# Altium schematic sheet EG8010.SchDoc: =DocumentName
size A4; CompanyName: "AS Manufacturing" LLC; Organization: "AS Manufacturing" LLC; Address1: 5 Sklyarenka St.; Address2: Kyiv 04073; Address3: Ukraine; Address4: https://ajax.systems/en/; SheetNumber: 3; SheetTotal: 10; Template_version: 1.0.1
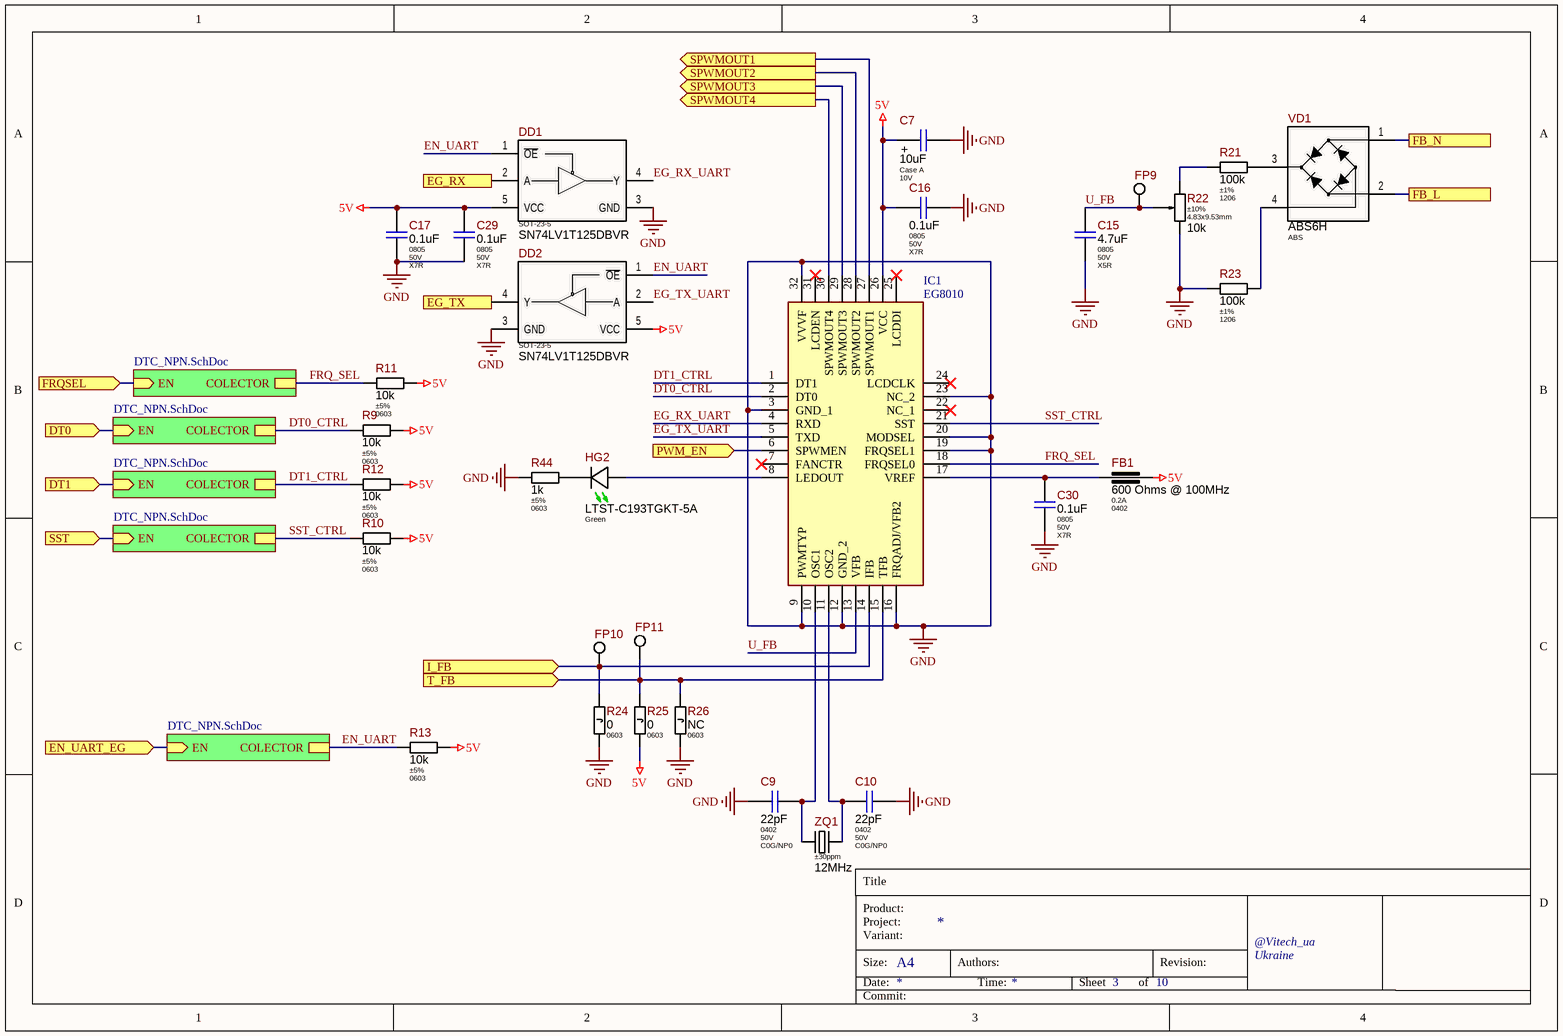
[diagram p0: EG8010.SchDoc]

## Parts
C7  Package: Case A  Voltage: 10V  [C_TANTAL_CASE_A_MED]  (hidden comment: 10uF)
C9  Package: 0402  Voltage: 50V  Dielectric Type: C0G/NP0  [C_CERAMIC_0402_MED]  (hidden comment: 22pF)
C10  Package: 0402  Voltage: 50V  Dielectric Type: C0G/NP0  [C_CERAMIC_0402_MED]  (hidden comment: 22pF)
C15  Package: 0805  Voltage: 50V  Dielectric Type: X5R  [C_CERAMIC_0805_MED]  (hidden comment: 4.7uF)
C16  Package: 0805  Voltage: 50V  Dielectric Type: X7R  [CAP-0805(2012)X85T10]  (hidden comment: 0.1uF)
C17  Package: 0805  Voltage: 50V  Dielectric Type: X7R  [CAP-0805(2012)X85T10]  (hidden comment: 0.1uF)
C29  Package: 0805  Voltage: 50V  Dielectric Type: X7R  [CAP-0805(2012)X85T10]  (hidden comment: 0.1uF)
C30  Package: 0805  Voltage: 50V  Dielectric Type: X7R  [CAP-0805(2012)X85T10]  (hidden comment: 0.1uF)
DD1  SN74LV1T125DBVR  [SOT-23-5]
DD2  SN74LV1T125DBVR  [SOT-23-5]
FB1  value 600 Ohms @ 100MHz  Current: 0.2A  Package: 0402  [BLM15xxxxxSN1x_MED]  (hidden comment: BLM15BD601SN1D)
FP9  PAD-1.75mm  [PAD-1.75mm]  (value not drawn)  (no BOM)
FP10  PAD-1.75mm  [PAD-1.75mm]  (value not drawn)  (no BOM)
FP11  PAD-1.75mm  [PAD-1.75mm]  (value not drawn)  (no BOM)
HG2  Color: Green  [LTST-C193xGKT-5A]  (hidden comment: LTST-C193TGKT-5A)
IC1  EG8010  [QFP80P900X900X160-32N]
R9  Tolerance: ±5%  Package: 0603  [R_ANY_CHIP_0603_MED]  (hidden comment: 10k)
R10  Tolerance: ±5%  Package: 0603  [R_ANY_CHIP_0603_MED]  (hidden comment: 10k)
R11  Tolerance: ±5%  Package: 0603  [R_ANY_CHIP_0603_MED]  (hidden comment: 10k)
R12  Tolerance: ±5%  Package: 0603  [R_ANY_CHIP_0603_MED]  (hidden comment: 10k)
R13  Tolerance: ±5%  Package: 0603  [R_ANY_CHIP_0603_MED]  (hidden comment: 10k)
R21  Tolerance: ±1%  Package: 1206  [R_ANY_CHIP_1206_MED]  (hidden comment: 100k)
R22  Tolerance: ±10%  Package: 4.83x9.53mm  [3296W-1-xxx]  (hidden comment: 10k)
R23  Tolerance: ±1%  Package: 1206  [R_ANY_CHIP_1206_MED]  (hidden comment: 100k)
R24  Package: 0603  [R_ANY_CHIP_0603_MED]  (hidden comment: 0)
R25  Package: 0603  [R_ANY_CHIP_0603_MED]  (hidden comment: 0)
R26  Package: 0603  [R_ANY_CHIP_0603_MED]  (hidden comment: NC)
R44  Tolerance: ±5%  Package: 0603  [R_ANY_CHIP_0603_MED]  (hidden comment: 1k)
VD1  Package: ABS  [ABSxx-Series]  (hidden comment: ABS6H)
ZQ1  Frequency Tolerance: ±30ppm  Frequency: 12MHz  [CSM4-Series]  (hidden comment: CSM4Z-A2B3C3-40-12.0D18)

## Sub-sheets
OC = DTC_NPN.SchDoc: EN (in), COLECTOR
OC = DTC_NPN.SchDoc: EN (in), COLECTOR
OC = DTC_NPN.SchDoc: EN (in), COLECTOR
OC = DTC_NPN.SchDoc: EN (in), COLECTOR
OC = DTC_NPN.SchDoc: EN (in), COLECTOR

## Ports
DT0 (in), DT1 (in), EG_RX (in), EG_TX (out), EN_UART_EG (in), FB_L, FB_N, FRQSEL (in), I_FB (in), PWM_EN (in), SPWMOUT1 (out), SPWMOUT2 (out), SPWMOUT3 (out), SPWMOUT4 (out), SST (in), T_FB (in)

## Nets
5V: C7.1 C16.1 C17.1 C29.1 DD1.5(VCC) DD2.5(VCC) FB1.1 IC1.26(VCC) R9.2 R10.2 R11.2 R12.2 R13.2 R25.2
GND: C7.2 C9.1 C10.2 C15.2 C16.2 C17.2 C29.2 C30.2 DD1.3(GND) DD2.3(GND) IC1.3(GND_1) IC1.9(PWMTYP) IC1.12(GND_2) IC1.16(FRQADJ/VFB2) IC1.19(FRQSEL1) IC1.20(MODSEL) IC1.23(NC_2) IC1.32(VVVF) R22.1(CCW) R23.1 R24.2 R26.2 R44.1
DT0: port DT0, sheet OC/EN
DT0_CTRL: IC1.2(DT0) R9.1 ; sheet OC/COLECTOR
DT1: port DT1, sheet OC/EN
DT1_CTRL: IC1.1(DT1) R12.1 ; sheet OC/COLECTOR
EG_RX: DD1.2(A) ; port EG_RX
EG_RX_UART: DD1.4(Y) IC1.4(RXD)
EG_TX: DD2.4(Y) ; port EG_TX
EG_TX_UART: DD2.2(A) IC1.5(TXD)
EN_UART: DD1.1(~{OE}) DD2.1(~{OE}) R13.1 ; sheet OC/COLECTOR
EN_UART_EG: port EN_UART_EG, sheet OC/EN
FB_L: VD1.2 ; port FB_L
FB_N: VD1.1 ; port FB_N
FRQ_SEL: IC1.18(FRQSEL0) R11.1 ; sheet OC/COLECTOR
FRQSEL: port FRQSEL, sheet OC/EN
I_FB: FP10.1 IC1.14(IFB) R24.1 ; port I_FB
PWM_EN: IC1.6(SPWMEN) ; port PWM_EN
SPWMOUT1: IC1.27(SPWMOUT1) ; port SPWMOUT1
SPWMOUT2: IC1.28(SPWMOUT2) ; port SPWMOUT2
SPWMOUT3: IC1.29(SPWMOUT3) ; port SPWMOUT3
SPWMOUT4: IC1.30(SPWMOUT4) ; port SPWMOUT4
SST: port SST, sheet OC/EN
SST_CTRL: IC1.21(SST) R10.1 ; sheet OC/COLECTOR
T_FB: FP11.1 IC1.15(TFB) R25.1 R26.1 ; port T_FB
U_FB: C15.1 FP9.1 IC1.13(VFB) R22.2(WIPER)
NetC9_2: C9.2 IC1.10(OSC1) ZQ1.2(XTAL2)
NetC10_1: C10.1 IC1.11(OSC2) ZQ1.1(XTAL1)
NetC30_1: C30.1 FB1.2 IC1.17(VREF)
NetHG2_AN: HG2.AN(Anode) IC1.8(LEDOUT)
NetHG2_CA: HG2.CA(Cathode) R44.2
NetR21_1: R21.1 R22.3(CW)
NetR21_2: R21.2 VD1.3(+)
NetR23_2: R23.2 VD1.4(-)

Not connected (* = marked no-connect by the designer): IC1 7(FANCTR)* 22(NC_1)* 24(LCDCLK)* 25(LCDDI)* 31(LCDEN)*

## Notes on the sheet
- Title
- Product:
- Project:
- Size:
- Date:
- Variant:
- A4
- Authors:
- Time:
- Sheet
- of
- Revision:
- @Vitech_ua
- Commit:
- (in symbol 293D106X9010A2TE3) +

## Library data of the parts
C7 = 293D106X9010A2TE3: 10uF 10V ±10% Case A Tantalum Capacitor RoHS, 3.4Ohm; Manufacturer: Vishay; Ajax_1C_ID: 58999; Ajax_1C_PN: 10uF 10V case A Vishay 293D106X9010A2TE3 Tantalum Capacitor SMD RoHS; Ajax_1С_Status: RND Only; Standard Lead Time: 20 Weeks; Component Status: Released; Dielectric Type: NONE; GUID_1C: 304cf5a9-8da3-11ed-a366-005056994834; Value: 10uF; Part Number: 293D106X9010A2TE3; Part Type: Tantalum; Component Type: SMD; Temperature Range: -55°C ~ 125°C; Tolerance: ±10%; ComponentLink1URL: https://eu.mouser.com/datasheet/2/427/293d-1763499.pdf; Supplier 1: Mouser; Supplier Part Number 1: 74-293D106X9010A2TE3; Replacement: NONE; Price: 0,1; ComponentLink1Description: Datasheet
C9 C10 = CL05C220JB5NNNC: 22pF 50V NP0, C0G ±5% 0402 Ceramic Capacitor RoHS; Manufacturer: Samsung Electro-Mechanics; Ajax_1C_ID: 26744; Ajax_1C_PN: 22pF 50V COG 5% 0402 Samsung CL05C220JB5NNNC Ceramic Capacitor SMD RoHS; Ajax_1С_Status: Substitution; Standard Lead Time: 22 Weeks; Component Status: Released; Replacement: NONE; GUID_1C: 5b73e2ce-71ce-11eb-ab70-0050569f2651; Value: 22pF; Part Number: CL05C220JB5NNNC; Part Type: Ceramic / C0G(NP0) / 0402; Component Type: SMD; Temperature Range: -55°C ~ 125°C; Tolerance: ±5%; ComponentLink1URL: https://media.digikey.com/pdf/Data%20Sheets/Samsung%20PDFs/CL_Series_MLCC_ds.pdf; Supplier 1: Digi-Key; Supplier Part Number 1: 1276-1116-2-ND; Price: 0,0034; ComponentLink1Description: Datasheet
C15 = GRM21BR61H475KE51L: 4.7uF 50V X5R ±10% 0805 Ceramic Capacitor RoHS; Manufacturer: Murata Electronics; Ajax_1C_ID: 10966; Ajax_1C_PN: 4.7uF 50V X5R 10% 0805 GRM21BR61H475KE51L/CL21A475KBQNNNE Ceramic Capacitor SMD RoHS; Ajax_1С_Status: Mass Production; Standard Lead Time: 15 Weeks; Component Status: Released; Replacement: NONE; GUID_1C: c30c0b00-b370-11e7-8189-14dda9d2d04d; Value: 4.7uF; Part Number: GRM21BR61H475KE51L; Part Type: Ceramic / X5R / 0805; Component Type: SMD; Temperature Range: -55°C ~ 85°C; Tolerance: ±10%; ComponentLink1URL: https://search.murata.co.jp/Ceramy/image/img/A01X/G101/ENG/GRM21BR61H475KE51-01.pdf; Supplier 1: Digi-Key; Supplier Part Number 1: 490-10751-2-ND; Price: 0,0396; ComponentLink1Description: Datasheet
C16 C17 C29 C30 = CL21B104KBCNNNC: 100nF 50V X7R ±10% 0805 Ceramic Capacitor RoHS; Manufacturer: Samsung Electro-Mechanics; Ajax_1C_ID: 1251; Ajax_1C_PN: 100nF 50V X7R 10% 0805 CL21B104KBCNNNC Ceramic Capacitor SMD RoHS; Ajax_1С_Status: Mass Production; Standard Lead Time: 22 Weeks; Component Status: Released; Replacement: NONE; GUID_1C: 2c368b99-dd41-11e0-af93-6c626deda1bb; Value: 0.1uF; Part Number: CL21B104KBCNNNC; Part Type: Ceramic / X7R / 0805; Component Type: SMD; Temperature Range: -55°C ~ 125°C; Tolerance: ±10%; ComponentLink1URL: https://media.digikey.com/pdf/Data%20Sheets/Samsung%20PDFs/CL_Series_MLCC_ds.pdf; Supplier 1: Digi-Key; Supplier Part Number 1: 1276-1003-2-ND; Price: 0,00700031; ComponentLink1Description: Datasheet
DD1 DD2 = SN74LV1T125DBVR: Single Power Supply Single Buffer Gate with 3-State Output CMOS Logic Level Shifter, SOT-23-5; Manufacturer: Texas Instruments; Ajax_1C_ID: 37412; Ajax_1C_PN: SN74LV1T125DBVRG4 микросхема SOT-23-5 TI; Ajax_1С_Status: RND Only; Standard Lead Time: 35 Weeks; Component Status: On Review; Replacement: NONE; GUID_1C: 2979ae79-574b-11ec-a356-005056994834; Package: SOT-23-5; Part Number: SN74LV1T125DBVR; Part Type: Logic / Level Translator; Component Type: SMD; Temperature Range: -40°C ~ 125°C; ComponentLink1URL: https://www.ti.com/lit/ds/symlink/sn74lv1t125.pdf; Supplier 1: Digi-Key; Supplier Part Number 1: 296-37172-2-ND; Price: 0,386; ComponentLink1Description: Datasheet
FB1 = BLM15BD601SN1D: 600 Ohms @ 100MHz Power Line Ferrite Bead 0402, 200mA 650mOhm; Manufacturer: Murata Electronics; Ajax_1C_ID: 50383; Ajax_1C_PN: 600R BLM15BD601SN1D 0402 Murata Ferrite Bead; Ajax_1С_Status: RND Only; Saturation Current: NONE; Tolerance: ±25%; Component Status: Released; Standard Lead Time: 26 Weeks; GUID_1C: 598dd509-398f-11ed-a363-005056994834; Part Number: BLM15BD601SN1D; Part Type: Ferrite Bead; Component Type: SMD; Temperature Range: -55°C ~ 125°C; ComponentLink1URL: https://eu.mouser.com/datasheet/2/281/ENFA0018-1915754.pdf; Supplier 1: Mouser; Supplier Part Number 1: 81-BLM15BD601SN1D; Replacement: NONE; Price: 0,05; ComponentLink1Description: Datasheet
FP9-FP11 = PAD-1.75mm: 1.75mm Pad for Plug-In or Receptacle; Ajax_1C_PN: NONE; Ajax_1С_Status: RND Only; Component Status: Released; Part Number: PAD-1.75mm; Component Type: PTH; Manufacturer: NONE; Part Type: Pad; Temperature Range: NONE; ComponentLink1URL: NONE; Replacement: NONE; Price: NONE; ComponentLink1Description: Datasheet
HG2 = LTST-C193TGKT-5A: Indication LED, Green 525nm, Clear, SMD 0603, Vf 2.5V - 3.1V, 28 ~ 280mcd @ 5 mA, 130°; Manufacturer: Lite-On Optoelectronics; Ajax_1C_ID: 10369; Ajax_1C_PN: LTST-C193TGKT-5A Green SMD LED 0603 12mcd 5mA 130deg RoHS pcs; Ajax_1С_Status: Mass Production; Component Status: Released; Replacement: NONE; GUID_1C: 4b87c4c2-6263-11e7-811b-14dda9d2d04d; Part Number: LTST-C193TGKT-5A; Part Type: LED / 0603; Component Type: SMD; Package: 0603; Wavelength: 525nm; Temperature Range: -20°C ~ 80°C; ComponentLink1URL: https://media.digikey.com/pdf/Data%20Sheets/Lite-On%20PDFs/LTST-C193TGKT-5A.pdf; Supplier 1: Digi-Key; Supplier Part Number 1: 160-1832-2-ND; Price: 0,10177143; ComponentLink1Description: Datasheet
IC1 = EG8010: Integrated Circuit; Manufacturer_Name: Glenair; Datasheet Link: https://datasheetspdf.com/pdf-file/729849/EGMicro/EG8010/1; Height: 1.6mm; Manufacturer_Part_Number: EG8010
R9-R13 = RC0603JR-0710KL: 10 kOhms ±5%, 1/10W 0603 Thick Film Resistor; Manufacturer: Yageo; Ajax_1C_ID: 2860; Ajax_1C_PN: 10k 5% 0603 Resistors SMD RoHS; Ajax_1С_Status: Mass Production; Power Rating: 0.1W; Voltage: 75V; Component Status: Released; Temperature Stability: ±100ppm/°C; Replacement: NONE; GUID_1C: df4c2852-e567-11e2-9779-6c626deda1bb; Value: 10k; Part Number: RC0603JR-0710KL; Component Type: SMD; Part Type: Thick Film; Temperature Range: -55°C ~ 155°C; ComponentLink1URL: https://eu.mouser.com/datasheet/2/447/PYu_RC_Group_51_RoHS_L_10-1664068.pdf; Supplier 1: Digi-Key; Supplier Part Number 1: 311-10KGRTR-ND; Price: 0,0006; ComponentLink1Description: Datasheet
R21 R23 = RC1206FR-07100KL: 100 kOhms ±1%, 1/4W 1206 Thick Film Resistor; Manufacturer: Yageo; Ajax_1C_ID: 14373; Ajax_1C_PN: 100k 1% 1206 Resistors SMD RoHS; Ajax_1С_Status: Mass Production; Power Rating: 0.25W; Voltage: 200V; Component Status: Released; Temperature Stability: ±100ppm/°C; Replacement: NONE; GUID_1C: 93b23056-f3fc-11e8-ab4c-0050569f2651; Value: 100k; Part Number: RC1206FR-07100KL; Component Type: SMD; Part Type: Thick Film; Temperature Range: -55°C ~ 155°C; ComponentLink1URL: https://eu.mouser.com/datasheet/2/447/PYu_RC_Group_51_RoHS_L_10-1664068.pdf; Supplier 1: Digi-Key; Supplier Part Number 1: 311-100KFRTR-ND; Price: 0,00288; ComponentLink1Description: Datasheet
R22 = 3296W-1-103LF: 10 kOhms ±10% Trimmer Resistor, 0.5W, Through Hole 3/8", 4.83x9.53mm, 10.03mm Height; Manufacturer: Bourns; Ajax_1C_PN: NONE; Ajax_1С_Status: RND Only; Component Status: On Review; Temperature Stability: ±100ppm/°C; Value: 10k; Part Number: 3296W-1-103LF; Component Type: PTH; Part Type: Trimming Potentiometer; Power Rating: 0.5W; Temperature Range: -55°C ~ 125°C; ComponentLink1URL: https://www.bourns.com/data/global/pdfs/3296.pdf; Supplier 1: Mouser; Supplier Part Number 1: 652-3296W-1-103LF; Replacement: NONE; Price: NONE; ComponentLink1Description: Datasheet
R24-R26 = RC0603JR-070RL: 0 Ohms Jumper, 1/10W 0603 Thick Film Resistor; Manufacturer: Yageo; Tolerance: ±5%; Ajax_1C_ID: 2857; Ajax_1C_PN: 0R 5% 0603 Resistors SMD RoHS; Ajax_1С_Status: Mass Production; Power Rating: 0.1W; Voltage: 75V; Component Status: Released; Temperature Stability: NONE; GUID_1C: df4c284c-e567-11e2-9779-6c626deda1bb; Part Number: RC0603JR-070RL; Component Type: SMD; Part Type: Thick Film; Temperature Range: -55°C ~ 155°C; ComponentLink1URL: https://eu.mouser.com/datasheet/2/447/PYu_RC_Group_51_RoHS_L_10-1664068.pdf; Supplier 1: Digi-Key; Supplier Part Number 1: 311-0.0GRTR-ND; Replacement: NONE; Price: 0,0006; ComponentLink1Description: Datasheet
  R24 R25: Value: 0
  R26: Value: NC
R44 = RC0603JR-071KL: 1 kOhms ±5%, 1/10W 0603 Thick Film Resistor; Manufacturer: Yageo; Ajax_1C_ID: 28124; Ajax_1C_PN: 1k 5% 0603 Resistors SMD RoHS; Ajax_1С_Status: Mass Production; Power Rating: 0.1W; Voltage: 75V; Component Status: Released; Temperature Stability: ±100ppm/°C; Replacement: NONE; GUID_1C: fbc5fd6b-8d66-11eb-ab70-0050569f2651; Value: 1k; Part Number: RC0603JR-071KL; Component Type: SMD; Part Type: Thick Film; Temperature Range: -55°C ~ 155°C; ComponentLink1URL: https://eu.mouser.com/datasheet/2/447/PYu_RC_Group_51_RoHS_L_11-1984063.pdf; Supplier 1: Digi-Key; Supplier Part Number 1: 311-1.0KGRTR-ND; Price: 0,00072; ComponentLink1Description: Datasheet
VD1 = ABS6H: 1A, 600V Standard Bridge Rectifier, ABS Package; Manufacturer: Taiwan Semiconductor; Ajax_1C_ID: 34652; Ajax_1C_PN: ABS6H 600V 1A Bridge Rectifier LGE ABS; Ajax_1С_Status: RND Only; Component Status: Released; Vf: 0.95V @ 0.4A; Replacement: NONE; GUID_1C: 734c9af7-1f64-11ec-ab76-0050569f2651; Part Number: ABS6H; Part Type: Array; Component Type: SMD; Marking: ABS6H; Current: 1A; Voltage: 600V; Temperature Range: -55°C ~ 150°C; ComponentLink1URL: \\altiumdb.ajax.local\files\Datasheet\Diodes\ABS2 SERIES_M2103.pdf; Supplier 1: Mouser; Supplier Part Number 1: 821-ABS6H; Price: 0,0254; ComponentLink1Description: Datasheet
ZQ1 = CSM4Z-A2B3C3-40-12.0D18: 12MHz, 18pF, ±30ppm, 40Ohm ESR, 1mW DL Crystal Quartz; Manufacturer: Cardinal Components Inc.; Ajax_1C_ID: 28125; Ajax_1C_PN: 12.000 MHz 30ppm 18pF CSM4Z-A2B3C3-40-12.0D18 кварцевый резонатор; Ajax_1С_Status: RND Only; Component Status: Released; Standard Lead Time: 8 Weeks; Replacement: NONE; GUID_1C: 0d925abc-8d67-11eb-ab70-0050569f2651; Part Number: CSM4Z-A2B3C3-40-12.0D18; Part Type: Crystal; Component Type: SMD; Load Capacitance: 18pF; Frequency Stability: ±30ppm; Temperature Range: -40°C ~ 85 °C; ComponentLink1URL: https://www.cardinalxtal.com/uploads/files/csm4-csm5.pdf; Supplier 1: Digi-Key; Supplier Part Number 1: 370-1146-2-ND; Price: 0,505; ComponentLink1Description: Datasheet